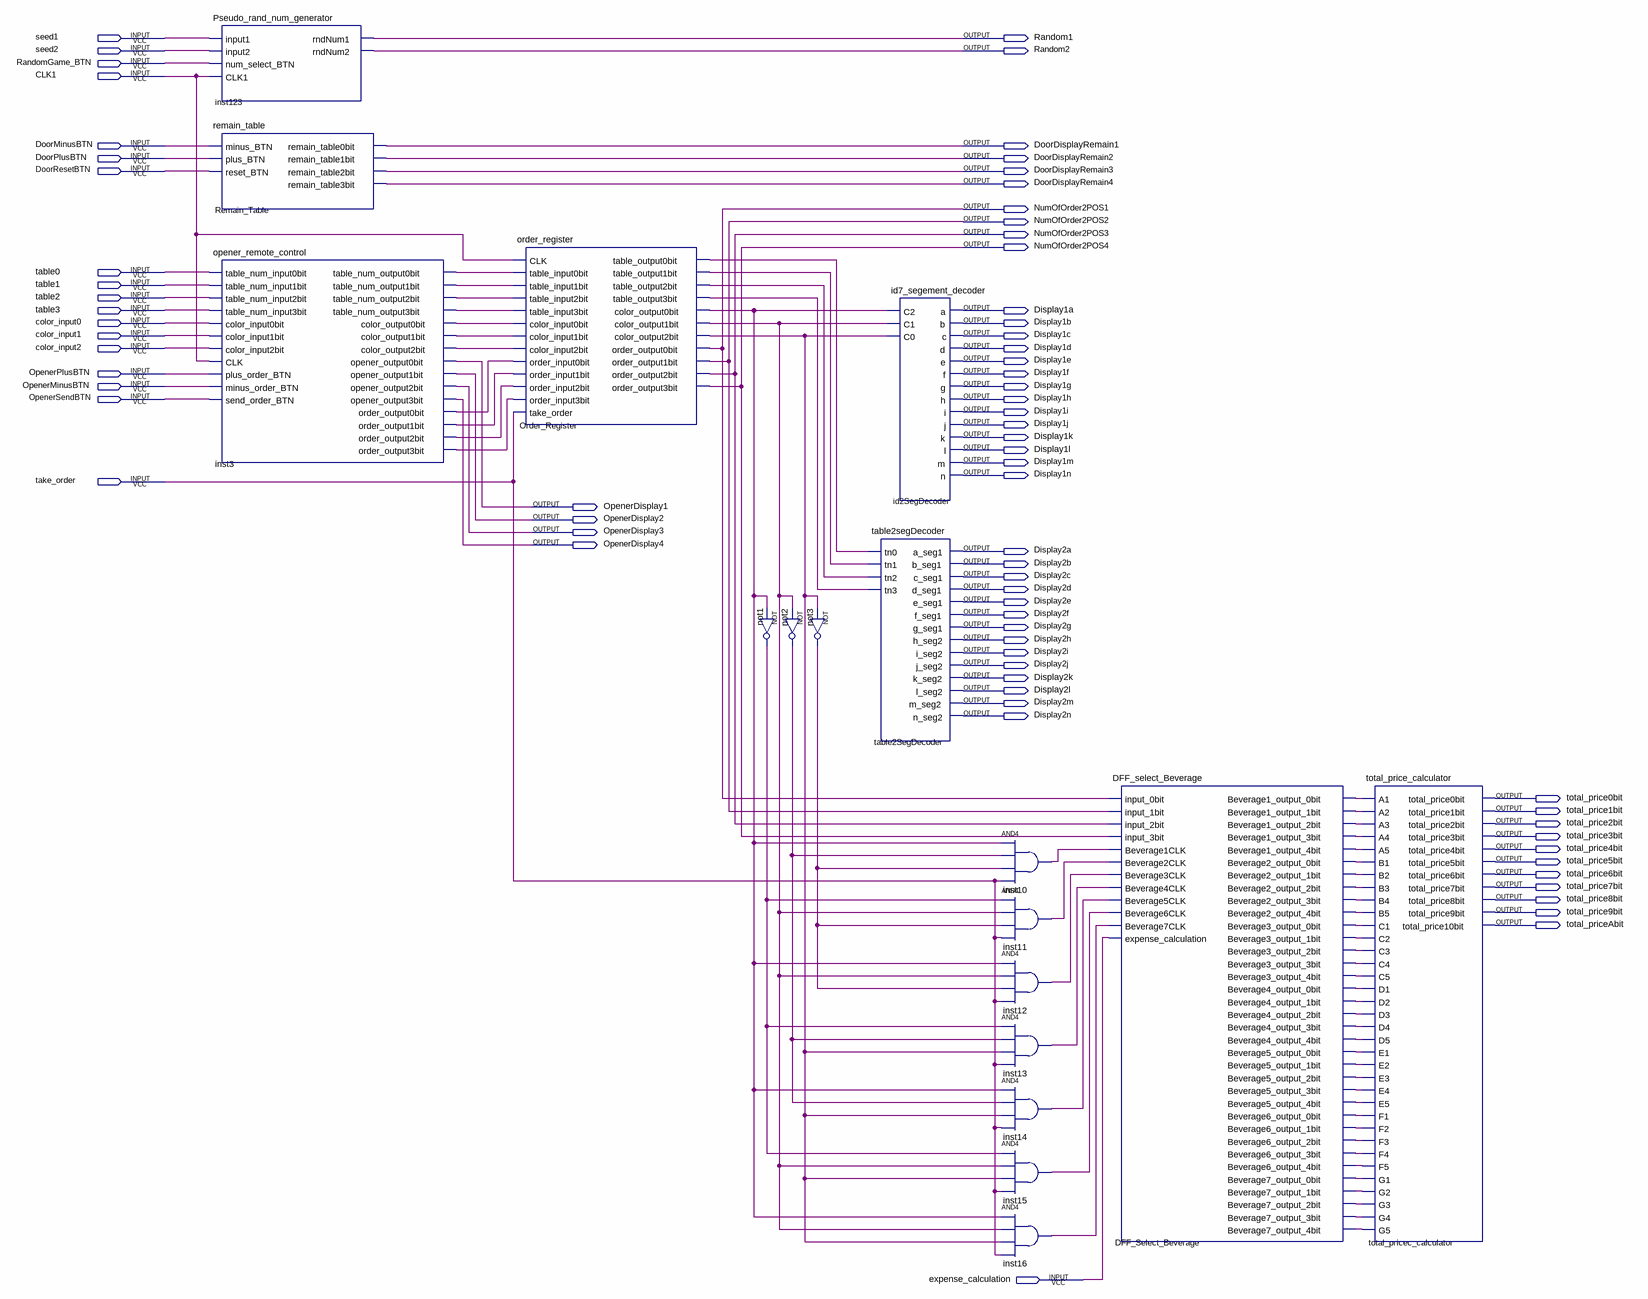
[diagram p0: schematic sheet]
// Quartus schematic bar_management_system.bdf as structural Verilog: 18 symbols, 72 pins
module bar_management_system (
  input  seed1,
  input  seed2,
  input  RandomGame_BTN,
  input  CLK1,
  input  DoorMinusBTN,
  input  DoorPlusBTN,
  input  DoorResetBTN,
  input  table0,
  input  table1,
  input  table2,
  input  table3,
  input  color_input0,
  input  color_input1,
  input  color_input2,
  input  OpenerPlusBTN,
  input  OpenerMinusBTN,
  input  OpenerSendBTN,
  input  take_order,
  input  expense_calculation,
  output Random1,
  output Random2,
  output DoorDisplayRemain1,
  output DoorDisplayRemain2,
  output DoorDisplayRemain3,
  output DoorDisplayRemain4,
  output NumOfOrder2POS1,
  output NumOfOrder2POS2,
  output NumOfOrder2POS3,
  output NumOfOrder2POS4,
  output Display1a,
  output Display1b,
  output Display1c,
  output Display1d,
  output Display1e,
  output Display1f,
  output Display1g,
  output Display1h,
  output Display1i,
  output Display1j,
  output Display1k,
  output Display1l,
  output Display1m,
  output Display1n,
  output OpenerDisplay1,
  output OpenerDisplay2,
  output OpenerDisplay3,
  output OpenerDisplay4,
  output Display2a,
  output Display2b,
  output Display2c,
  output Display2d,
  output Display2e,
  output Display2f,
  output Display2g,
  output Display2h,
  output Display2i,
  output Display2j,
  output Display2k,
  output Display2l,
  output Display2m,
  output Display2n,
  output total_price0bit,
  output total_price1bit,
  output total_price2bit,
  output total_price3bit,
  output total_price4bit,
  output total_price5bit,
  output total_price6bit,
  output total_price7bit,
  output total_price8bit,
  output total_price9bit,
  output total_priceAbit
);

  wire DFF_Select_Beverage_beverage1_output_0bit, DFF_Select_Beverage_beverage1_output_1bit,
       DFF_Select_Beverage_beverage1_output_2bit, DFF_Select_Beverage_beverage1_output_3bit,
       DFF_Select_Beverage_beverage1_output_4bit, DFF_Select_Beverage_beverage2_output_0bit,
       DFF_Select_Beverage_beverage2_output_1bit, DFF_Select_Beverage_beverage2_output_2bit,
       DFF_Select_Beverage_beverage2_output_3bit, DFF_Select_Beverage_beverage2_output_4bit,
       DFF_Select_Beverage_beverage3_output_0bit, DFF_Select_Beverage_beverage3_output_1bit,
       DFF_Select_Beverage_beverage3_output_2bit, DFF_Select_Beverage_beverage3_output_3bit,
       DFF_Select_Beverage_beverage3_output_4bit, DFF_Select_Beverage_beverage4_output_0bit,
       DFF_Select_Beverage_beverage4_output_1bit, DFF_Select_Beverage_beverage4_output_2bit,
       DFF_Select_Beverage_beverage4_output_3bit, DFF_Select_Beverage_beverage4_output_4bit,
       DFF_Select_Beverage_beverage5_output_0bit, DFF_Select_Beverage_beverage5_output_1bit,
       DFF_Select_Beverage_beverage5_output_2bit, DFF_Select_Beverage_beverage5_output_3bit,
       DFF_Select_Beverage_beverage5_output_4bit, DFF_Select_Beverage_beverage6_output_0bit,
       DFF_Select_Beverage_beverage6_output_1bit, DFF_Select_Beverage_beverage6_output_2bit,
       DFF_Select_Beverage_beverage6_output_3bit, DFF_Select_Beverage_beverage6_output_4bit,
       DFF_Select_Beverage_beverage7_output_0bit, DFF_Select_Beverage_beverage7_output_1bit,
       DFF_Select_Beverage_beverage7_output_2bit, DFF_Select_Beverage_beverage7_output_3bit,
       DFF_Select_Beverage_beverage7_output_4bit, inst3_color_output0bit, inst3_color_output1bit,
       inst3_color_output2bit, inst3_order_output0bit, inst3_order_output1bit, inst3_order_output2bit,
       inst3_order_output3bit, inst3_table_num_output0bit, inst3_table_num_output1bit,
       inst3_table_num_output2bit, inst3_table_num_output3bit, inst10_out, inst11_out, inst12_out,
       inst13_out, inst14_out, inst15_out, inst16_out, not1_out, not2_out, not3_out,
       Order_Register_color_output0bit, Order_Register_color_output1bit, Order_Register_color_output2bit,
       Order_Register_table_output0bit, Order_Register_table_output1bit, Order_Register_table_output2bit,
       Order_Register_table_output3bit;

  Pseudo_rand_num_generator inst123 (
    .input1(seed1), .input2(seed2), .num_select_BTN(RandomGame_BTN), .CLK1(CLK1), .rndNum1(Random1),
    .rndNum2(Random2));
  remain_table Remain_Table (
    .minus_BTN(DoorMinusBTN), .plus_BTN(DoorPlusBTN), .reset_BTN(DoorResetBTN),
    .remain_table0bit(DoorDisplayRemain1), .remain_table1bit(DoorDisplayRemain2),
    .remain_table2bit(DoorDisplayRemain3), .remain_table3bit(DoorDisplayRemain4));
  opener_remote_control inst3 (
    .table_num_input0bit(table0), .table_num_input1bit(table1), .table_num_input2bit(table2),
    .table_num_input3bit(table3), .color_input0bit(color_input0), .color_input1bit(color_input1),
    .color_input2bit(color_input2), .CLK(CLK1), .plus_order_BTN(OpenerPlusBTN),
    .minus_order_BTN(OpenerMinusBTN), .send_order_BTN(OpenerSendBTN),
    .table_num_output0bit(inst3_table_num_output0bit), .table_num_output1bit(inst3_table_num_output1bit),
    .table_num_output2bit(inst3_table_num_output2bit), .table_num_output3bit(inst3_table_num_output3bit),
    .color_output0bit(inst3_color_output0bit), .color_output1bit(inst3_color_output1bit),
    .color_output2bit(inst3_color_output2bit), .opener_output0bit(OpenerDisplay1),
    .opener_output1bit(OpenerDisplay2), .opener_output2bit(OpenerDisplay3),
    .opener_output3bit(OpenerDisplay4), .order_output0bit(inst3_order_output0bit),
    .order_output1bit(inst3_order_output1bit), .order_output2bit(inst3_order_output2bit),
    .order_output3bit(inst3_order_output3bit));
  order_register Order_Register (
    .CLK(CLK1), .table_input0bit(inst3_table_num_output0bit), .table_input1bit(inst3_table_num_output1bit),
    .table_input2bit(inst3_table_num_output2bit), .table_input3bit(inst3_table_num_output3bit),
    .color_input0bit(inst3_color_output0bit), .color_input1bit(inst3_color_output1bit),
    .color_input2bit(inst3_color_output2bit), .order_input0bit(inst3_order_output0bit),
    .order_input1bit(inst3_order_output1bit), .order_input2bit(inst3_order_output2bit),
    .order_input3bit(inst3_order_output3bit), .take_order(take_order),
    .table_output0bit(Order_Register_table_output0bit), .table_output1bit(Order_Register_table_output1bit),
    .table_output2bit(Order_Register_table_output2bit), .table_output3bit(Order_Register_table_output3bit),
    .color_output0bit(Order_Register_color_output0bit), .color_output1bit(Order_Register_color_output1bit),
    .color_output2bit(Order_Register_color_output2bit), .order_output0bit(NumOfOrder2POS1),
    .order_output1bit(NumOfOrder2POS2), .order_output2bit(NumOfOrder2POS3), .order_output3bit(NumOfOrder2POS4));
  not not1 (not1_out, Order_Register_color_output0bit);
  not not2 (not2_out, Order_Register_color_output1bit);
  not not3 (not3_out, Order_Register_color_output2bit);
  table2segDecoder table2SegDecoder (
    .tn0(Order_Register_table_output0bit), .tn1(Order_Register_table_output1bit),
    .tn2(Order_Register_table_output2bit), .tn3(Order_Register_table_output3bit), .a_seg1(Display2a),
    .b_seg1(Display2b), .c_seg1(Display2c), .d_seg1(Display2d), .e_seg1(Display2e), .f_seg1(Display2f),
    .g_seg1(Display2g), .h_seg2(Display2h), .i_seg2(Display2i), .j_seg2(Display2j), .k_seg2(Display2k),
    .l_seg2(Display2l), .m_seg2(Display2m), .n_seg2(Display2n));
  id7_segement_decoder id2SegDecoder (
    .C2(Order_Register_color_output0bit), .C1(Order_Register_color_output1bit),
    .C0(Order_Register_color_output2bit), .a(Display1a), .b(Display1b), .c(Display1c), .d(Display1d),
    .e(Display1e), .f(Display1f), .g(Display1g), .h(Display1h), .i(Display1i), .j(Display1j), .k(Display1k),
    .l(Display1l), .m(Display1m), .n(Display1n));
  and inst10 (inst10_out, Order_Register_color_output0bit, not2_out, not3_out, take_order);
  and inst11 (inst11_out, not1_out, Order_Register_color_output1bit, not3_out, take_order);
  and inst12 (inst12_out, Order_Register_color_output0bit, Order_Register_color_output1bit, not3_out, take_order);
  and inst13 (inst13_out, not1_out, not2_out, Order_Register_color_output2bit, take_order);
  and inst14 (inst14_out, Order_Register_color_output0bit, not2_out, Order_Register_color_output2bit, take_order);
  and inst15 (inst15_out, not1_out, Order_Register_color_output1bit, Order_Register_color_output2bit, take_order);
  and inst16 (inst16_out, Order_Register_color_output0bit, Order_Register_color_output1bit, Order_Register_color_output2bit, take_order);
  DFF_select_Beverage DFF_Select_Beverage (
    .input_0bit(NumOfOrder2POS1), .input_1bit(NumOfOrder2POS2), .input_2bit(NumOfOrder2POS3),
    .input_3bit(NumOfOrder2POS4), .Beverage1CLK(inst10_out), .Beverage2CLK(inst11_out),
    .Beverage3CLK(inst12_out), .Beverage4CLK(inst13_out), .Beverage5CLK(inst14_out),
    .Beverage6CLK(inst15_out), .Beverage7CLK(inst16_out), .expense_calculation(expense_calculation),
    .Beverage1_output_0bit(DFF_Select_Beverage_beverage1_output_0bit),
    .Beverage1_output_1bit(DFF_Select_Beverage_beverage1_output_1bit),
    .Beverage1_output_2bit(DFF_Select_Beverage_beverage1_output_2bit),
    .Beverage1_output_3bit(DFF_Select_Beverage_beverage1_output_3bit),
    .Beverage1_output_4bit(DFF_Select_Beverage_beverage1_output_4bit),
    .Beverage2_output_0bit(DFF_Select_Beverage_beverage2_output_0bit),
    .Beverage2_output_1bit(DFF_Select_Beverage_beverage2_output_1bit),
    .Beverage2_output_2bit(DFF_Select_Beverage_beverage2_output_2bit),
    .Beverage2_output_3bit(DFF_Select_Beverage_beverage2_output_3bit),
    .Beverage2_output_4bit(DFF_Select_Beverage_beverage2_output_4bit),
    .Beverage3_output_0bit(DFF_Select_Beverage_beverage3_output_0bit),
    .Beverage3_output_1bit(DFF_Select_Beverage_beverage3_output_1bit),
    .Beverage3_output_2bit(DFF_Select_Beverage_beverage3_output_2bit),
    .Beverage3_output_3bit(DFF_Select_Beverage_beverage3_output_3bit),
    .Beverage3_output_4bit(DFF_Select_Beverage_beverage3_output_4bit),
    .Beverage4_output_0bit(DFF_Select_Beverage_beverage4_output_0bit),
    .Beverage4_output_1bit(DFF_Select_Beverage_beverage4_output_1bit),
    .Beverage4_output_2bit(DFF_Select_Beverage_beverage4_output_2bit),
    .Beverage4_output_3bit(DFF_Select_Beverage_beverage4_output_3bit),
    .Beverage4_output_4bit(DFF_Select_Beverage_beverage4_output_4bit),
    .Beverage5_output_0bit(DFF_Select_Beverage_beverage5_output_0bit),
    .Beverage5_output_1bit(DFF_Select_Beverage_beverage5_output_1bit),
    .Beverage5_output_2bit(DFF_Select_Beverage_beverage5_output_2bit),
    .Beverage5_output_3bit(DFF_Select_Beverage_beverage5_output_3bit),
    .Beverage5_output_4bit(DFF_Select_Beverage_beverage5_output_4bit),
    .Beverage6_output_0bit(DFF_Select_Beverage_beverage6_output_0bit),
    .Beverage6_output_1bit(DFF_Select_Beverage_beverage6_output_1bit),
    .Beverage6_output_2bit(DFF_Select_Beverage_beverage6_output_2bit),
    .Beverage6_output_3bit(DFF_Select_Beverage_beverage6_output_3bit),
    .Beverage6_output_4bit(DFF_Select_Beverage_beverage6_output_4bit),
    .Beverage7_output_0bit(DFF_Select_Beverage_beverage7_output_0bit),
    .Beverage7_output_1bit(DFF_Select_Beverage_beverage7_output_1bit),
    .Beverage7_output_2bit(DFF_Select_Beverage_beverage7_output_2bit),
    .Beverage7_output_3bit(DFF_Select_Beverage_beverage7_output_3bit),
    .Beverage7_output_4bit(DFF_Select_Beverage_beverage7_output_4bit));
  total_price_calculator total_pricec_calculator (
    .A1(DFF_Select_Beverage_beverage1_output_0bit), .A2(DFF_Select_Beverage_beverage1_output_1bit),
    .A3(DFF_Select_Beverage_beverage1_output_2bit), .A4(DFF_Select_Beverage_beverage1_output_3bit),
    .A5(DFF_Select_Beverage_beverage1_output_4bit), .B1(DFF_Select_Beverage_beverage2_output_0bit),
    .B2(DFF_Select_Beverage_beverage2_output_1bit), .B3(DFF_Select_Beverage_beverage2_output_2bit),
    .B4(DFF_Select_Beverage_beverage2_output_3bit), .B5(DFF_Select_Beverage_beverage2_output_4bit),
    .C1(DFF_Select_Beverage_beverage3_output_0bit), .C2(DFF_Select_Beverage_beverage3_output_1bit),
    .C3(DFF_Select_Beverage_beverage3_output_2bit), .C4(DFF_Select_Beverage_beverage3_output_3bit),
    .C5(DFF_Select_Beverage_beverage3_output_4bit), .D1(DFF_Select_Beverage_beverage4_output_0bit),
    .D2(DFF_Select_Beverage_beverage4_output_1bit), .D3(DFF_Select_Beverage_beverage4_output_2bit),
    .D4(DFF_Select_Beverage_beverage4_output_3bit), .D5(DFF_Select_Beverage_beverage4_output_4bit),
    .E1(DFF_Select_Beverage_beverage5_output_0bit), .E2(DFF_Select_Beverage_beverage5_output_1bit),
    .E3(DFF_Select_Beverage_beverage5_output_2bit), .E4(DFF_Select_Beverage_beverage5_output_3bit),
    .E5(DFF_Select_Beverage_beverage5_output_4bit), .F1(DFF_Select_Beverage_beverage6_output_0bit),
    .F2(DFF_Select_Beverage_beverage6_output_1bit), .F3(DFF_Select_Beverage_beverage6_output_2bit),
    .F4(DFF_Select_Beverage_beverage6_output_3bit), .F5(DFF_Select_Beverage_beverage6_output_4bit),
    .G1(DFF_Select_Beverage_beverage7_output_0bit), .G2(DFF_Select_Beverage_beverage7_output_1bit),
    .G3(DFF_Select_Beverage_beverage7_output_2bit), .G4(DFF_Select_Beverage_beverage7_output_3bit),
    .G5(DFF_Select_Beverage_beverage7_output_4bit), .total_price0bit(total_price0bit),
    .total_price1bit(total_price1bit), .total_price2bit(total_price2bit), .total_price3bit(total_price3bit),
    .total_price4bit(total_price4bit), .total_price5bit(total_price5bit), .total_price6bit(total_price6bit),
    .total_price7bit(total_price7bit), .total_price8bit(total_price8bit), .total_price9bit(total_price9bit),
    .total_price10bit(total_priceAbit));
endmodule
